# Altium project hw_design.PrjPcb (part 1 of 5)
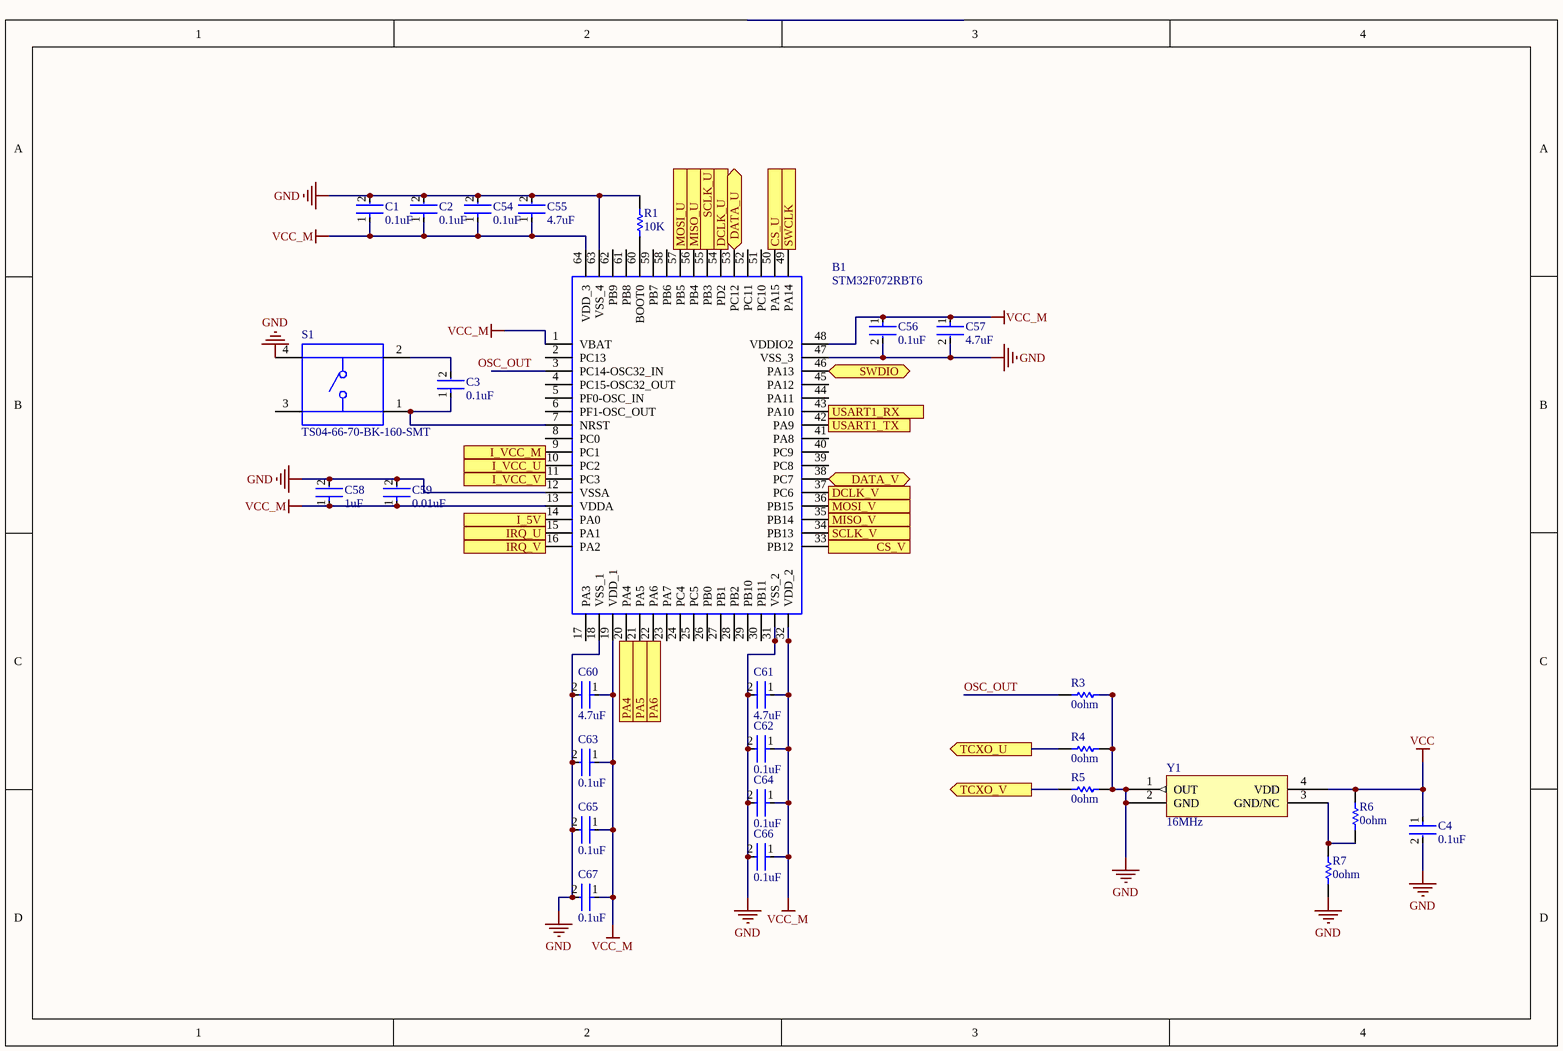
[diagram p0: mcu.SchDoc]
5 sheets, 149 parts. Net scope: flat (ports and power ports of the same name join across sheets).
Board file: main_board.PcbDoc
Sheets:
  mcu.SchDoc
  comms_uhf.SchDoc
  comms_vhf.SchDoc
  power_regulation.SchDoc
  connectors.SchDoc

## Sheet mcu.SchDoc
size A4; SheetNumber: 1; SheetTotal: 5

### Parts
B1  STM32F072RBT6  [QFP50P1200X1200X160-64N]
C1  0.1uF  [FP-C0805C-DN-IPC_A]
C2  0.1uF  [FP-C0805C-DN-IPC_A]
C3  0.1uF  [FP-C0805C-DN-IPC_A]
C4  0.1uF  [FP-C0805C-DN-IPC_A]
C54  0.1uF  [FP-C0805C-DN-IPC_A]
C55  4.7uF  [FP-C0805C-DN-IPC_A]
C56  0.1uF  [FP-C0805C-DN-IPC_A]
C57  4.7uF  [FP-C0805C-DN-IPC_A]
C58  1uF  [FP-C0805C-DN-IPC_A]
C59  0.01uF  [FP-C0805C-DN-IPC_A]
C60  4.7uF  [FP-C0805C-DN-IPC_A]
C61  4.7uF  [FP-C0805C-DN-IPC_A]
C62  0.1uF  [FP-C0805C-DN-IPC_A]
C63  0.1uF  [FP-C0805C-DN-IPC_A]
C64  0.1uF  [FP-C0805C-DN-IPC_A]
C65  0.1uF  [FP-C0805C-DN-IPC_A]
C66  0.1uF  [FP-C0805C-DN-IPC_A]
C67  0.1uF  [FP-C0805C-DN-IPC_A]
R1  10K  [FP-C0805C-DN-IPC_A]
R3  0ohm  [FP-C0805C-DN-IPC_A]
R4  0ohm  [FP-C0805C-DN-IPC_A]
R5  0ohm  [FP-C0805C-DN-IPC_A]
R6  0ohm  [FP-C0805C-DN-IPC_A]
R7  0ohm  [FP-C0805C-DN-IPC_A]
S1  TS04-66-70-BK-160-SMT  [SW_TS04-66-70-BK-160-SMT]
Y1  16MHz  [OSCCC320X250X100N]

### Ports
CS_U (out), CS_V (out), DATA_U (bidir), DATA_V (bidir), DCLK_U (in), DCLK_V (in), I_5V (in), I_VCC_M (in), I_VCC_U (in), I_VCC_V (in), IRQ_U (in), IRQ_V (in), MISO_U (in), MISO_V (in), MOSI_U (out), MOSI_V (out), PA4 (out), PA5 (out), PA6 (out), SCLK_U (out), SCLK_V (out), SWCLK (in), SWDIO (bidir), TCXO_U (out), TCXO_V (out), USART1_RX (in), USART1_TX (out)

### Nets
GND: B1.12(VSSA) B1.18(VSS_1) B1.31(VSS_2) B1.47(VSS_3) B1.63(VSS_4) C1.2 C2.2 C4.2 C54.2 C55.2 C56.2 C57.2 C58.2 C59.2 C60.2 C61.2 C62.2 C63.2 C64.2 C65.2 C66.2 C67.2 R1.2 R3.1 R4.1 R5.2 R7.2 S1.4 Y1.1(OUT) Y1.2(GND)
VCC: C4.1 R6.1 Y1.4(VDD)
VCC_M: B1.1(VBAT) B1.13(VDDA) B1.19(VDD_1) B1.32(VDD_2) B1.48(VDDIO2) B1.64(VDD_3) C1.1 C2.1 C54.1 C55.1 C56.1 C57.1 C58.1 C59.1 C60.1 C61.1 C62.1 C63.1 C64.1 C65.1 C66.1 C67.1
CS_U: B1.50(PA15) ; port CS_U
CS_V: B1.33(PB12) ; port CS_V
DATA_U: B1.53(PC12) ; port DATA_U
DATA_V: B1.38(PC7) ; port DATA_V
DCLK_U: B1.54(PD2) ; port DCLK_U
DCLK_V: B1.37(PC6) ; port DCLK_V
I_5V: B1.14(PA0) ; port I_5V
I_VCC_M: B1.9(PC1) ; port I_VCC_M
I_VCC_U: B1.10(PC2) ; port I_VCC_U
I_VCC_V: B1.11(PC3) ; port I_VCC_V
IRQ_U: B1.15(PA1) ; port IRQ_U
IRQ_V: B1.16(PA2) ; port IRQ_V
MISO_U: B1.56(PB4) ; port MISO_U
MISO_V: B1.35(PB14) ; port MISO_V
MOSI_U: B1.57(PB5) ; port MOSI_U
MOSI_V: B1.36(PB15) ; port MOSI_V
OSC_OUT: R3.2
PA4: B1.20(PA4) ; port PA4
PA5: B1.21(PA5) ; port PA5
PA6: B1.22(PA6) ; port PA6
SCLK_U: B1.55(PB3) ; port SCLK_U
SCLK_V: B1.34(PB13) ; port SCLK_V
SWCLK: B1.49(PA14) ; port SWCLK
SWDIO: B1.46(PA13) ; port SWDIO
TCXO_U: R4.2 ; port TCXO_U
TCXO_V: R5.1 ; port TCXO_V
USART1_RX: B1.43(PA10) ; port USART1_RX
USART1_TX: B1.42(PA9) ; port USART1_TX
NetB1_7: B1.7(NRST) C3.1 S1.1
NetB1_60: B1.60(BOOT0) R1.1
NetC3_2: C3.2 S1.2
NetR6_2: R6.2 R7.1 Y1.3(GND/NC)

Not connected (* = marked no-connect by the designer): B1 2(PC13) 3(PC14-OSC32_IN) 4(PC15-OSC32_OUT) 5(PF0-OSC_IN) 6(PF1-OSC_OUT) 8(PC0) 17(PA3) 23(PA7) 24(PC4) 25(PC5) 26(PB0) 27(PB1) 28(PB2) 29(PB10) 30(PB11) 39(PC8) 40(PC9) 41(PA8) 44(PA11) 45(PA12) 51(PC10) 52(PC11) 58(PB6) 59(PB7) 61(PB8) 62(PB9); S1 3

### Notes on the sheet
- Labels drawn without touching a wire or pin: OSC_OUT

### Library data of the parts
B1 = STM32F072RBT6: 32-Bit MCU 128K Flash USB2.0 CAN LQFP64 STMicroelectronics STM32F072RBT6, 32bit ARM Cortex M0 Microcontroller, 48MHz, 64 kB, 128 kB Flash, 64-Pin LQFP; Geometry.Height: 1.6mm; Mouser Part Number: 511-STM32F072RBT6; Mouser Price/Stock: https://www.mouser.co.uk/ProductDetail/STMicroelectronics/STM32F072RBT6?qs=xf9JV0PLFEcuk6sTlnutaw%3D%3D; Manufacturer_Name: STMicroelectronics; Manufacturer_Part_Number: STM32F072RBT6; Datasheet Link: http://www.st.com/st-web-ui/static/active/en/resource/technical/document/datasheet/DM00090510.pdf
C1-C4 C54 C56 C62-C67 = C0805C104K5RACTU: Cap Ceramic 0.1uF 50V X7R 10% SMD 2.0 x 1.2 mm 125 C Paper T/R; Manufacturer: KEMET; Capacitance: 100nF; Voltage: 500V; Supplier 1: Digi-Key; Manufacturer Part Number: C0805C104K5RACTU; RoHS: Yes; Category: Ceramic Capacitors; Pricing 1: 1=0.15000, 10=0.10500, 50=0.05960, 100=0.04940, 500=0.03466, 1000=0.02869 (USD); Mount: Surface Mount,PCB; Case/Package: 0805; Number of Pins: 2; Case Code (Imperial): 0805; Case Code (Metric): 2012; Dielectric Material: Ceramic; Contact Plating: Tin,Matte; Min Operating Temperature: -55°C; Max Operating Temperature: 125°C; Package Quantity: 4000; Voltage Rating: 50V; Tolerance: 10%; Packaging: Tape and Reel; Dielectric: X7R; Termination: SMD/SMT; Voltage Rating (DC): 50V; Series: C0805C; Construction: Flat; Length: 2mm; Width: 1.2mm; Height: 0.9mm; Thickness: 0.035inch; Depth: 1.25mm; Lead Pitch: 0.75mm; Radiation Hardening: No; REACH SVHC: No SVHC; RoHS Compliant: Yes; ComponentLink1URL: https://www.distrelec.biz/Web/Downloads/_t/ds/KEM_C1002_X7R_SMD_eng_tds.pdf?mime=application%2Fpdf&src-supplier=Distrelec; ComponentLink1Description: https://www.distrelec.biz/Web/Downloads/_t/ds/KEM_C1002_X7R_SMD_eng_tds.pdf?mime=application%2Fpdf&src-supplier=Distrelec; ComponentLink2URL: http://www.farnell.com/datasheets/2740684.pdf?src-supplier=Farnell; ComponentLink2Description: http://www.farnell.com/datasheets/2740684.pdf?src-supplier=Farnell; ComponentLink3URL: http://www.farnell.com/datasheets/2740684.pdf?src-supplier=Element14; ComponentLink3Description: http://www.farnell.com/datasheets/2740684.pdf?src-supplier=Element14; Supplier Part Number 1: 399-C0805C104K5RAC7800CT-ND; Stock 1: 2034176
C55 C57 C60 C61 = C0805C475K3PACTU: Cap Ceramic 4.7uF 25V X5R 10% SMD 0805 85°C Plastic T/R; Manufacturer: KEMET; Dissipation Factor: 5%; Supplier 1: Digi-Key; Manufacturer Part Number: C0805C475K3PACTU; RoHS: Yes; Category: Ceramic Capacitors; Pricing 1: 1=0.36000, 10=0.24800, 50=0.16500, 100=0.14020, 500=0.09900, 1000=0.08662 (USD); Mount: PCB,Surface Mount; Case/Package: 0805; Number of Pins: 2; Case Code (Imperial): 0805; Case Code (Metric): 2012; Dielectric Material: Ceramic; Contact Plating: Tin,Matte; Min Operating Temperature: -55°C; Max Operating Temperature: 85°C; Capacitance: 4.7uF; Tolerance: 10%; Packaging: Tape and Reel; Dielectric: X5R; Package Quantity: 2500; Series: C0805C; Termination: SMD/SMT; Voltage Rating (DC): 25V; Construction: Flat; Voltage: 25V; Length: 2mm; Width: 1.2mm; Height: 1.25mm; Depth: 1.25mm; Radiation Hardening: No; RoHS Compliant: Yes; Lead Free: Lead Free; REACH SVHC: No SVHC; ComponentLink1URL: https://datasheet.ciiva.com/3776/c0603c102k5racturegion-naregion-na-3776917.pdf?src-supplier=Arrow+Electronics; ComponentLink1Description: https://datasheet.ciiva.com/3776/c0603c102k5racturegion-naregion-na-3776917.pdf?src-supplier=Arrow+Electronics; ComponentLink2URL: https://datasheet.ciiva.com/18193/getdatasheetpartid-385757-18193895.pdf?src-supplier=Verical; ComponentLink2Description: https://datasheet.ciiva.com/18193/getdatasheetpartid-385757-18193895.pdf?src-supplier=Verical; ComponentLink3URL: https://datasheet.ciiva.com/18193/getdatasheetpartid-195812-18193898.pdf?src-supplier=Verical; ComponentLink3Description: https://datasheet.ciiva.com/18193/getdatasheetpartid-195812-18193898.pdf?src-supplier=Verical; ComponentLink4URL: https://datasheet.ciiva.com/7842/40889-7842614.pdf?src-supplier=Element14; ComponentLink4Description: https://datasheet.ciiva.com/7842/40889-7842614.pdf?src-supplier=Element14; ComponentLink5URL: https://datasheet.ciiva.com/22748/1918694-22748309.pdf?src-supplier=Element14; ComponentLink5Description: https://datasheet.ciiva.com/22748/1918694-22748309.pdf?src-supplier=Element14; Supplier Part Number 1: 399-C0805C475K3PAC7800CT-ND; Stock 1: 10860
C58 = C0805C105K4PACTU: Cap Ceramic 1uF 16V X5R 10% SMD 0805 85C Plastic T/R; Manufacturer: KEMET; Dissipation Factor: 5%; Supplier 1: Digi-Key; Manufacturer Part Number: C0805C105K4PACTU; RoHS: Yes; Category: Ceramic Capacitors; Pricing 1: 1=0.20000, 10=0.13400, 50=0.08060, 100=0.06810, 500=0.04662, 1000=0.04124 (USD); Mount: Surface Mount,PCB; Case/Package: 0805; Case Code (Metric): 2012; Case Code (Imperial): 0805; Dielectric Material: Ceramic; Min Operating Temperature: -55°C; Max Operating Temperature: 85°C; Capacitance: 1uF; Tolerance: 10%; Packaging: Tape and Reel; Voltage Rating: 16V; Package Quantity: 1; Voltage Rating (DC): 16V; Dielectric: X5R; Termination: SMD/SMT; Voltage: 16V; Series: C0805C; Construction: Flat; Length: 2mm; Width: 0.049inch; Height: 1.25mm; Thickness: 0.055inch; Depth: 1.25mm; Radiation Hardening: No; REACH SVHC: No SVHC; RoHS Compliant: Yes; Lead Free: Lead Free; ComponentLink1URL: http://www.farnell.com/datasheets/2745930.pdf?src-supplier=Farnell; ComponentLink1Description: http://www.farnell.com/datasheets/2745930.pdf?src-supplier=Farnell; ComponentLink2URL: http://uk.rs-online.com/webdocs/13da/0900766b813daa10.pdf?src-supplier=RSComponents; ComponentLink2Description: http://uk.rs-online.com/webdocs/13da/0900766b813daa10.pdf?src-supplier=RSComponents; ComponentLink3URL: http://components.arrow.com/part/dataview/43037300S8313636N7429?src-supplier=Arrow+Electronics; ComponentLink3Description: http://components.arrow.com/part/dataview/43037300S8313636N7429?src-supplier=Arrow+Electronics; ComponentLink4URL: http://uk.rs-online.com/webdocs/13da/0900766b813daa0f.pdf?src-supplier=RSComponents; ComponentLink4Description: http://uk.rs-online.com/webdocs/13da/0900766b813daa0f.pdf?src-supplier=RSComponents; ComponentLink5URL: https://search.kemet.com/component-edge/download/datasheet/C0805C105K4PAC.pdf?src-supplier=Avnet; ComponentLink5Description: https://search.kemet.com/component-edge/download/datasheet/C0805C105K4PAC.pdf?src-supplier=Avnet; ComponentLink6URL: http://www.farnell.com/datasheets/2745930.pdf?src-supplier=Newark; ComponentLink6Description: http://www.farnell.com/datasheets/2745930.pdf?src-supplier=Newark; ComponentLink7URL: https://search.kemet.com/component-edge/download/datasheet/C0805C105K4PAC.pdf?src-supplier=Allied+Electronics; ComponentLink7Description: https://search.kemet.com/component-edge/download/datasheet/C0805C105K4PAC.pdf?src-supplier=Allied+Electronics; ComponentLink8URL: http://www.farnell.com/datasheets/2745930.pdf?src-supplier=Element14; ComponentLink8Description: http://www.farnell.com/datasheets/2745930.pdf?src-supplier=Element14; ComponentLink9URL: https://www.verical.com/server-webapp/html/getDatasheet?partID=127986&src-supplier=Verical; ComponentLink9Description: https://www.verical.com/server-webapp/html/getDatasheet?partID=127986&src-supplier=Verical; ComponentLink10URL: http://www.farnell.com/datasheets/1824493.pdf?src-supplier=Newark; ComponentLink10Description: http://www.farnell.com/datasheets/1824493.pdf?src-supplier=Newark; ComponentLink11URL: http://www.kemet.com/Lists/ProductCatalog/Attachments/19/KEM_C1006_X5R_SMD.pdf?src-supplier=Avnet; ComponentLink11Description: http://www.kemet.com/Lists/ProductCatalog/Attachments/19/KEM_C1006_X5R_SMD.pdf?src-supplier=Avnet; ComponentLink12URL: https://search.kemet.com/component-edge/download/datasheet/C0805C105K4PAC.pdf?src-supplier=Mouser; ComponentLink12Description: https://search.kemet.com/component-edge/download/datasheet/C0805C105K4PAC.pdf?src-supplier=Mouser; ComponentLink13URL: https://api.kemet.com/component-edge/download/datasheet/C0805C105K4PAC.pdf?src-supplier=Digi-Key; ComponentLink13Description: https://api.kemet.com/component-edge/download/datasheet/C0805C105K4PAC.pdf?src-supplier=Digi-Key; ComponentLink14URL: https://search.kemet.com/component-edge/download/datasheet/C0805C105K4PAC.pdf?src-supplier=TTI; ComponentLink14Description: https://search.kemet.com/component-edge/download/datasheet/C0805C105K4PAC.pdf?src-supplier=TTI; Supplier Part Number 1: 399-C0805C105K4PAC7800CT-ND; Stock 1: 112717
C59 = C0805C103K5RAC-TU: Cap Ceramic 0.01uF 50V X7R 10% SMD 0805 125C Plastic T/R; Manufacturer: KEMET; Capacitance: 10nF; Supplier 1: RSComponents; Manufacturer Part Number: C0805C103K5RAC-TU; RoHS: Yes; Category: Ceramic Capacitors; Stock 1: 8800; Pricing 1: 25=0.14500, 100=0.13600, 250=0.12500, 500=0.11800, 1250=0.10800 (USD); Mount: PCB,Surface Mount; Case/Package: 0805; Number of Pins: 2; Case Code (Metric): 2012; Case Code (Imperial): 0805; Dielectric Material: Ceramic; Min Operating Temperature: -55°C; Max Operating Temperature: 125°C; Voltage Rating (DC): 50V; Tolerance: 10%; Voltage Rating: 50V; Packaging: Tape and Reel; Package Quantity: 4000; Dielectric: X7R; Termination: SMD/SMT; Voltage: 50V; Series: C0805C; Construction: Flat; Length: 2mm; Width: 1.2mm; Height: 0.78mm; Thickness: 0.035inch; Depth: 1.25mm; Lead Pitch: 0.75mm; Radiation Hardening: No; REACH SVHC: No SVHC; ComponentLink1URL: https://datasheet.ciiva.com/7172/1828800-7172412.pdf?src-supplier=Newark; ComponentLink1Description: https://datasheet.ciiva.com/7172/1828800-7172412.pdf?src-supplier=Newark; ComponentLink2URL: https://datasheet.ciiva.com/5904/kem-c1002-x7r-smd-5904709.pdf?src-supplier=Farnell; ComponentLink2Description: https://datasheet.ciiva.com/5904/kem-c1002-x7r-smd-5904709.pdf?src-supplier=Farnell; ComponentLink3URL: https://datasheet.ciiva.com/7842/kem-c1002-x7r-smd-7842533.pdf?src-supplier=Element14; ComponentLink3Description: https://datasheet.ciiva.com/7842/kem-c1002-x7r-smd-7842533.pdf?src-supplier=Element14; ComponentLink4URL: https://datasheet.ciiva.com/28672/1851736-28672830.pdf?src-supplier=Element14; ComponentLink4Description: https://datasheet.ciiva.com/28672/1851736-28672830.pdf?src-supplier=Element14; ComponentLink5URL: https://datasheet.ciiva.com/26923/getdatasheetpartid-759674-26923957.pdf?src-supplier=Verical; ComponentLink5Description: https://datasheet.ciiva.com/26923/getdatasheetpartid-759674-26923957.pdf?src-supplier=Verical; ComponentLink6URL: https://datasheet.ciiva.com/39122/docfinderpartnumberc0402c102k5ractu-39122923.pdf?src-supplier=Onlinecomponents.com; ComponentLink6Description: https://datasheet.ciiva.com/39122/docfinderpartnumberc0402c102k5ractu-39122923.pdf?src-supplier=Onlinecomponents.com; Supplier Part Number 1: 2644371
R1 = ERA-6AEB103V: 高精度、低温漂贴片电阻 10KΩ ±0.1% 1/8W ±25ppm/℃ 0805; Manufacturer: Panasonic; Voltage Rating: 100V; Resistance: 10kR; Power Rating: 125mW; Temperature Coefficient: 25ppm/°C; Supplier 1: Digi-Key; Manufacturer Part Number: ERA-6AEB103V; RoHS: Yes; Category: Chip SMD Resistors; Mount: Surface Mount; Case/Package: 0805; Number of Pins: 2; Case Code (Metric): 2012; Case Code (Imperial): 0805; Contact Plating: Tin; Min Operating Temperature: -55°C; Max Operating Temperature: 155°C; Packaging: Tape and Reel; Tolerance: 0.1%; Resistor Type: Thin Film; Voltage Rating (DC): 100V; Package Quantity: 5000; Termination: SMD/SMT; Number of Terminations: 2; Max Power Dissipation: 125mW; Series: ERA-6A; Construction: Rectangular; Resistance Tolerance: 0.1%; Technology: THIN FILM; Working Voltage: 100V; Length: 2mm; Width: 1.25mm; Height: 0.5mm; Depth: 1.25mm; Radiation Hardening: No; REACH SVHC: No SVHC; RoHS Compliant: Yes; Military Standard: Not; Lead Free: Lead Free; ComponentLink1URL: https://datasheet.ciiva.com/11810/0900766b80beefcc-11810466.pdf?src-supplier=RSComponents; ComponentLink1Description: https://datasheet.ciiva.com/11810/0900766b80beefcc-11810466.pdf?src-supplier=RSComponents; ComponentLink2URL: https://datasheet.ciiva.com/26335/453339-da-01-en-widerstand-0805-era-26335701.pdf?src-supplier=Conrad; ComponentLink2Description: https://datasheet.ciiva.com/26335/453339-da-01-en-widerstand-0805-era-26335701.pdf?src-supplier=Conrad; ComponentLink3URL: https://datasheet.ciiva.com/43455/485442-43455269.pdf?src-supplier=Farnell; ComponentLink3Description: https://datasheet.ciiva.com/43455/485442-43455269.pdf?src-supplier=Farnell; ComponentLink4URL: https://datasheet.ciiva.com/7830/485442-7830639.pdf?src-supplier=Element14; ComponentLink4Description: https://datasheet.ciiva.com/7830/485442-7830639.pdf?src-supplier=Element14; ComponentLink5URL: https://datasheet.ciiva.com/7830/485442-7830638.pdf?src-supplier=Element14; ComponentLink5Description: https://datasheet.ciiva.com/7830/485442-7830638.pdf?src-supplier=Element14; ComponentLink6URL: https://datasheet.ciiva.com/48529/era-eng-tds-48529783.pdf?src-supplier=Distrelec; ComponentLink6Description: https://datasheet.ciiva.com/48529/era-eng-tds-48529783.pdf?src-supplier=Distrelec; ComponentLink7URL: https://datasheet.ciiva.com/7830/485442-7830637.pdf?src-supplier=Element14; ComponentLink7Description: https://datasheet.ciiva.com/7830/485442-7830637.pdf?src-supplier=Element14; ComponentLink8URL: https://datasheet.ciiva.com/22785/485442-22785935.pdf?src-supplier=Farnell; ComponentLink8Description: https://datasheet.ciiva.com/22785/485442-22785935.pdf?src-supplier=Farnell; ComponentLink9URL: https://datasheet.ciiva.com/28513/485442-28513862.pdf?src-supplier=Element14; ComponentLink9Description: https://datasheet.ciiva.com/28513/485442-28513862.pdf?src-supplier=Element14; ComponentLink10URL: https://datasheet.ciiva.com/24072/aoa0000ce26-197354-24072839.pdf?src-supplier=Mouser; ComponentLink10Description: https://datasheet.ciiva.com/24072/aoa0000ce26-197354-24072839.pdf?src-supplier=Mouser; ComponentLink11URL: https://datasheet.ciiva.com/16776/70068849-16776328.pdf?src-supplier=Allied+Electronics; ComponentLink11Description: https://datasheet.ciiva.com/16776/70068849-16776328.pdf?src-supplier=Allied+Electronics; ComponentLink12URL: https://datasheet.ciiva.com/16762/70068849-16762828.pdf?src-supplier=Allied+Electronics; ComponentLink12Description: https://datasheet.ciiva.com/16762/70068849-16762828.pdf?src-supplier=Allied+Electronics; ComponentLink13URL: https://datasheet.ciiva.com/16200/aoa0000ce26-16200216.pdf?src-supplier=Future+Electronics; ComponentLink13Description: https://datasheet.ciiva.com/16200/aoa0000ce26-16200216.pdf?src-supplier=Future+Electronics; ComponentLink14URL: https://datasheet.ciiva.com/48531/aoa0000ce26-48531095.pdf?src-supplier=Avnet; ComponentLink14Description: https://datasheet.ciiva.com/48531/aoa0000ce26-48531095.pdf?src-supplier=Avnet; Supplier Part Number 1: P10KDACT-ND
R3-R7 = CRCW08050000Z0EA: CRCW Series 0805 0.125 W 0 Ohm Jumper Surface Mount Thick Film Chip Resistor; Manufacturer: Vishay; Power Rating: 125mW; Temperature Coefficient: 100ppm/°C; Voltage Rating: 150V; Tolerance: 1%; Resistance: 0mR; Supplier 1: Digi-Key; Manufacturer Part Number: CRCW08050000Z0EA; RoHS: Yes; Category: Chip SMD Resistors; Pricing 1: 1=0.10000, 10=0.04400, 25=0.03160, 50=0.02400, 100=0.01770, 250=0.01352, 500=0.01080, 1000=0.00795 (USD); Case/Package: 0805; Case Code (Imperial): 0805; Case Code (Metric): 2012; Contact Plating: Tin,Lead; Size Code: 0805; Weight: 0.000194oz; Min Operating Temperature: -55°C; Max Operating Temperature: 155°C; Packaging: Tape and Reel; Resistor Type: Thick Film; Series: CRCW; Termination: SMD/SMT; Package Quantity: 1; Number of Terminations: 2; Max Power Dissipation: 125mW; Construction: Rectangular; Voltage Rating (DC): 150V; Features: Automotive AEC-Q200; Technology: THICK FILM; Resistance Tolerance: 1%; Length: 2mm; Width: 1.25mm; Height: 0.45mm; Depth: 1.25mm; Radiation Hardening: No; RoHS Compliant: Yes; REACH SVHC: Unknown; Lead Free: Lead Free; Military Standard: Not; ComponentLink1URL: https://datasheet.ciiva.com/11811/0900766b80d98b26-11811304.pdf?src-supplier=RSComponents; ComponentLink1Description: https://datasheet.ciiva.com/11811/0900766b80d98b26-11811304.pdf?src-supplier=RSComponents; ComponentLink2URL: https://datasheet.ciiva.com/2463/dcrcwe3-2463037.pdf?src-supplier=Digi-Key; ComponentLink2Description: https://datasheet.ciiva.com/2463/dcrcwe3-2463037.pdf?src-supplier=Digi-Key; ComponentLink3URL: https://datasheet.ciiva.com/2463/dcrcwe3-2463038.pdf?src-supplier=Digi-Key; ComponentLink3Description: https://datasheet.ciiva.com/2463/dcrcwe3-2463038.pdf?src-supplier=Digi-Key; ComponentLink4URL: https://datasheet.ciiva.com/2463/dcrcwe3-2463039.pdf?src-supplier=Digi-Key; ComponentLink4Description: https://datasheet.ciiva.com/2463/dcrcwe3-2463039.pdf?src-supplier=Digi-Key; ComponentLink5URL: https://datasheet.ciiva.com/5543/dcrcwe3-109170-5543096.pdf?src-supplier=Mouser; ComponentLink5Description: https://datasheet.ciiva.com/5543/dcrcwe3-109170-5543096.pdf?src-supplier=Mouser; ComponentLink6URL: https://datasheet.ciiva.com/16389/dcrcwe3-16389338.pdf?src-supplier=Future+Electronics; ComponentLink6Description: https://datasheet.ciiva.com/16389/dcrcwe3-16389338.pdf?src-supplier=Future+Electronics; ComponentLink7URL: https://datasheet.ciiva.com/7841/1697337-7841629.pdf?src-supplier=Element14; ComponentLink7Description: https://datasheet.ciiva.com/7841/1697337-7841629.pdf?src-supplier=Element14; ComponentLink8URL: https://datasheet.ciiva.com/7841/1720486-7841839.pdf?src-supplier=Element14; ComponentLink8Description: https://datasheet.ciiva.com/7841/1720486-7841839.pdf?src-supplier=Element14; ComponentLink9URL: https://datasheet.ciiva.com/26314/fld-crcw-e3-data-en-26314630.pdf?src-supplier=Distrelec; ComponentLink9Description: https://datasheet.ciiva.com/26314/fld-crcw-e3-data-en-26314630.pdf?src-supplier=Distrelec; ComponentLink10URL: https://datasheet.ciiva.com/16719/70201119-16719706.pdf?src-supplier=Allied+Electronics; ComponentLink10Description: https://datasheet.ciiva.com/16719/70201119-16719706.pdf?src-supplier=Allied+Electronics; Supplier Part Number 1: 541-0.0ADKR-ND
S1 = TS04-66-70-BK-160-SMT: MF: {'manufacturer': u'CUI'}; Package: None; Value: *; Availability: Unavailable; Price: None; MP: TS04-66-70-BK-160-SMT
Y1 = TXETDDSANF-16.000000: Vctcxo @ 16.000MHZ, 2.8-3.3V, 2.5PPM; Manufacturer: Taitien Electronics; Max Supply Current: 2mA; Supplier 1: Digi-Key; Manufacturer Part Number: TXETDDSANF-16.000000; RoHS: Yes; Category: Oscillators; Stock 1: 4650; Mount: Surface Mount; Case/Package: SMD/SMT; Min Operating Temperature: -30°C; Max Operating Temperature: 85°C; Packaging: Tape and Reel; Frequency: 16MHz; Frequency Stability: 2.5ppm; Length: 0.126inch; Width: 0.098inch; Height: 0.039inch; ComponentLink1URL: http://www.taitien.com/wp-content/uploads/2015/12/XO-0076_TX.pdf?src-supplier=Digi-Key; ComponentLink1Description: http://www.taitien.com/wp-content/uploads/2015/12/XO-0076_TX.pdf?src-supplier=Digi-Key; Supplier Part Number 1: 1664-1278-1-ND